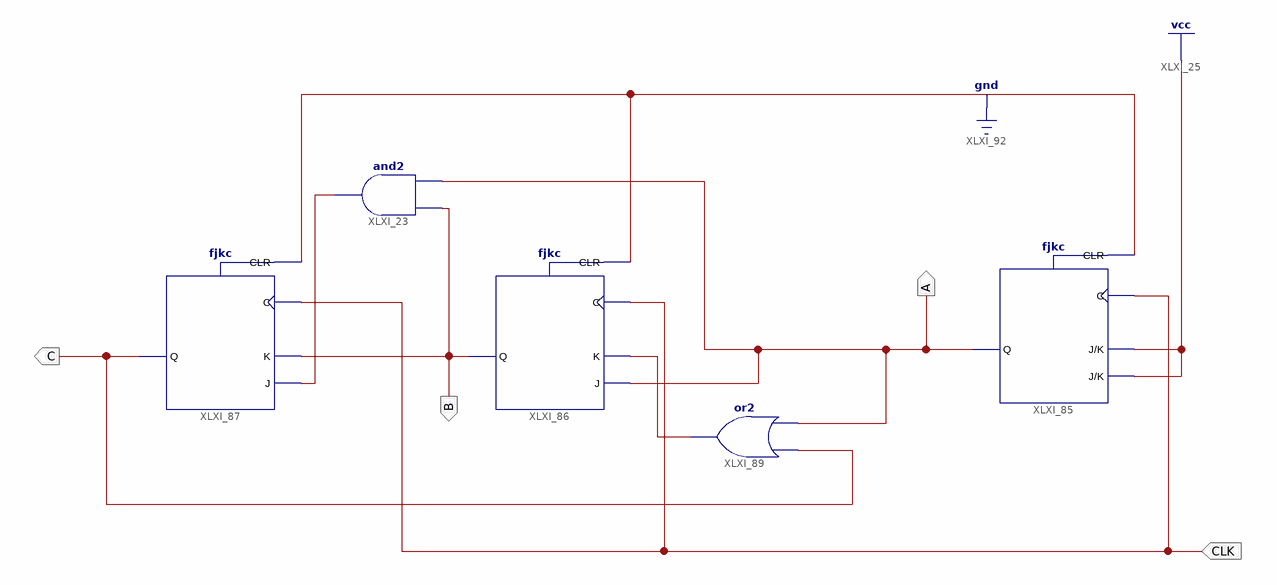
[diagram p0: schematic sheet 1]
// Xilinx ISE schematic count1_6.sch (spartan6) as structural Verilog: 5 symbols, 4 ports
module count1_6 (
  input  CLK,
  output A,
  output B,
  output C
);

  wire XLXN_45, XLXN_128;

  fjkc XLXI_85 (.C(CLK), .CLR(1'b0), .J(1'b1), .K(1'b1), .Q(A));
  fjkc XLXI_86 (.C(CLK), .CLR(1'b0), .J(A), .K(XLXN_128), .Q(B));
  fjkc XLXI_87 (.C(CLK), .CLR(1'b0), .J(XLXN_45), .K(B), .Q(C));
  and XLXI_23 (XLXN_45, A, B);
  or XLXI_89 (XLXN_128, A, C);
endmodule
